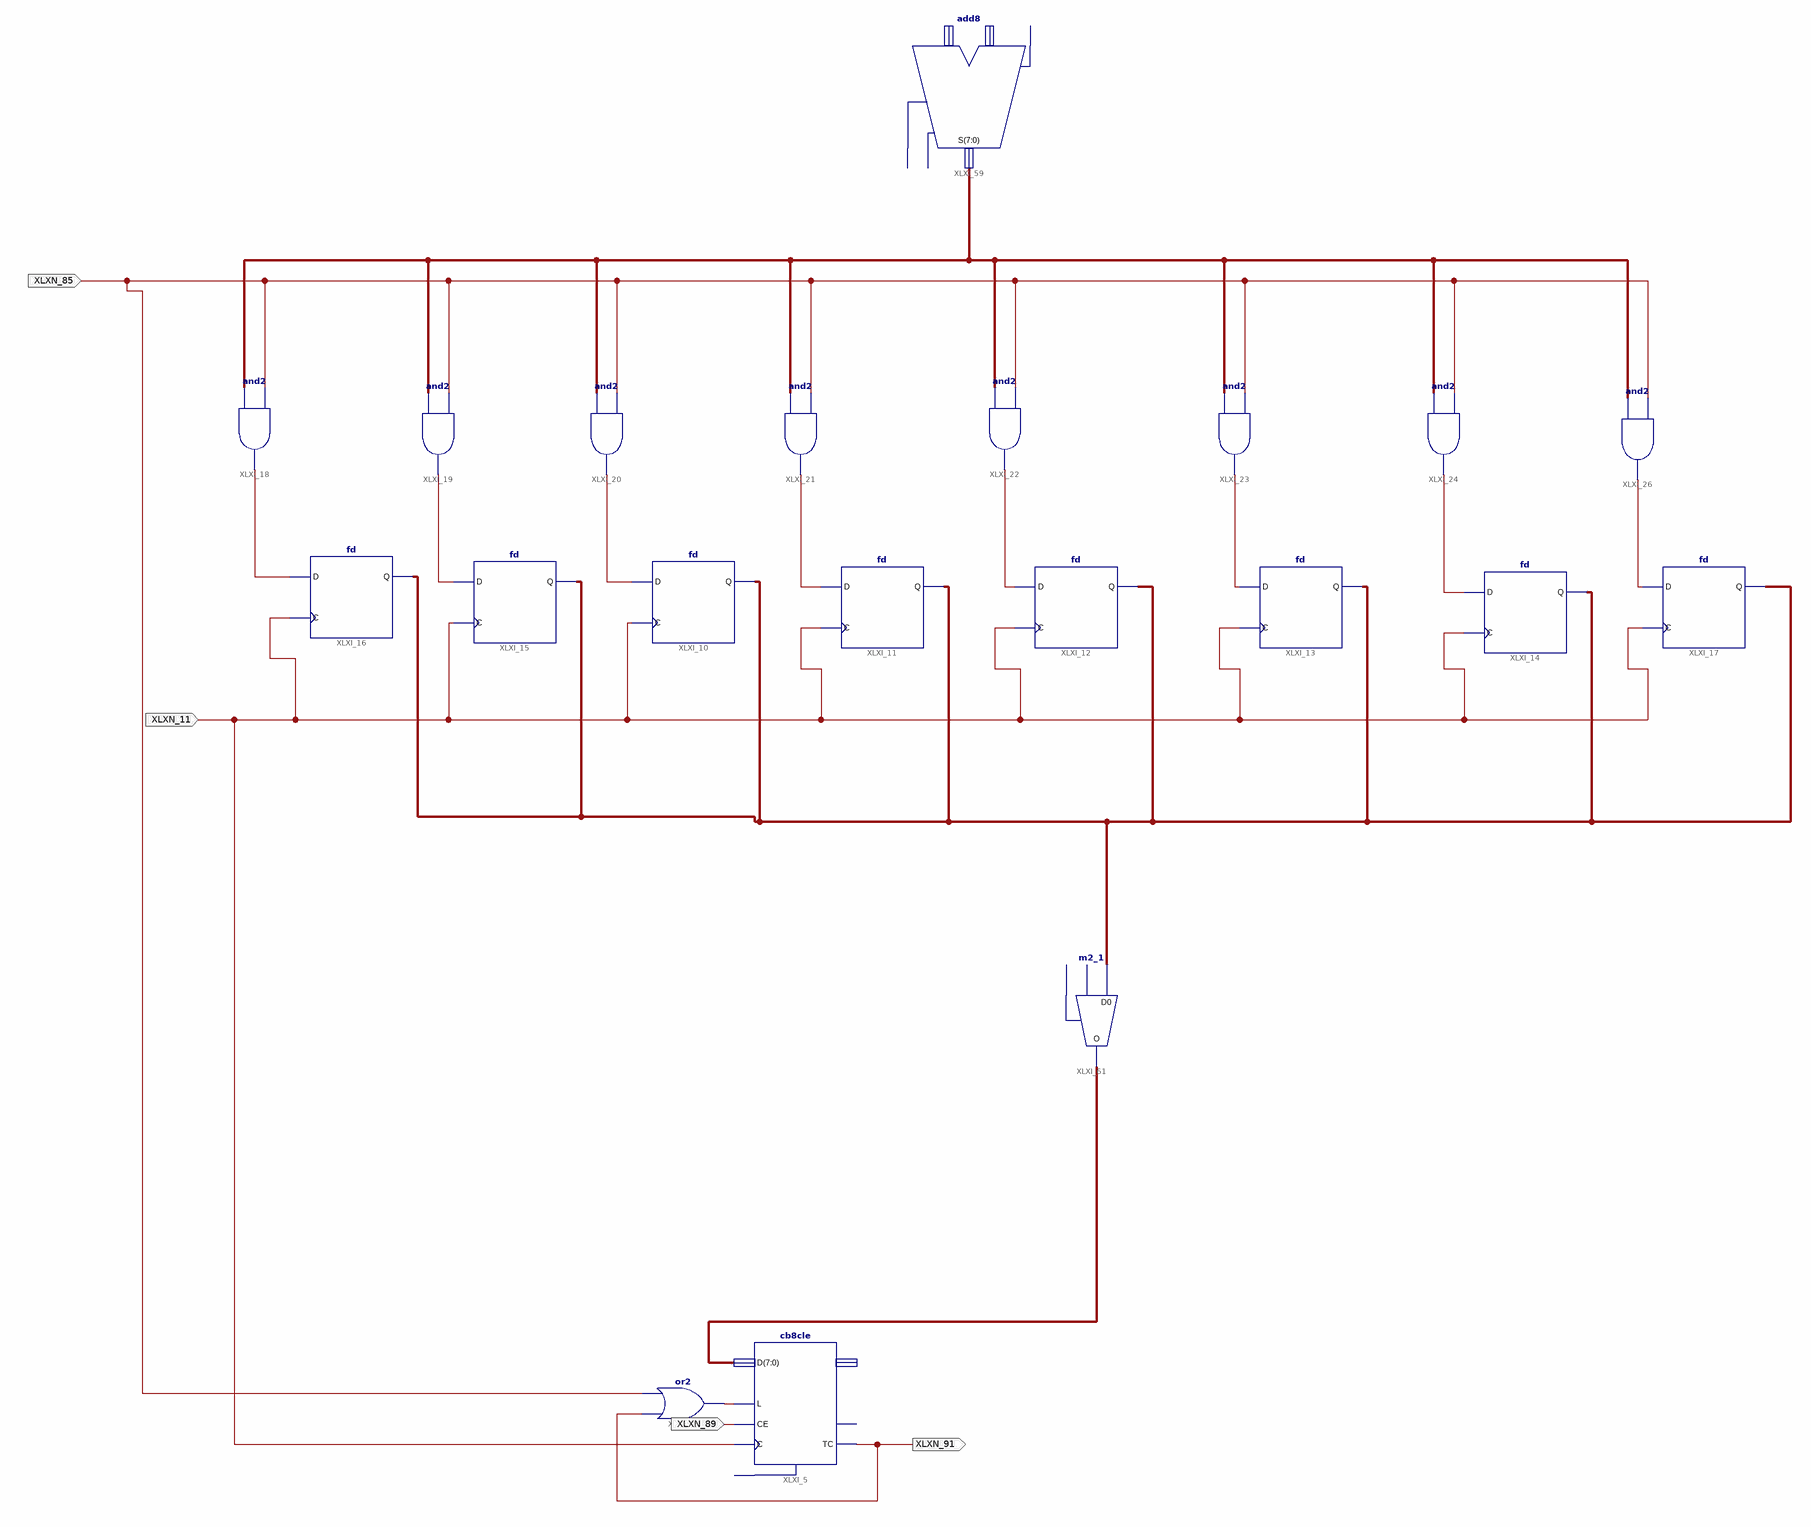
[diagram p0: schematic sheet 1]
// Xilinx ISE schematic timer.sch (spartan3e) as structural Verilog: 20 symbols, 4 ports
module timer (
  input  XLXN_11,
  input  XLXN_85,
  input  XLXN_89,
  output XLXN_91
);

  wire XLXN_12, XLXN_13, XLXN_14, XLXN_15, XLXN_16, XLXN_18, XLXN_19, XLXN_20, XLXN_88;
  wire [7:0] XLXN_87, XLXN_99, XLXN_101;

  fd XLXI_13 (.C(XLXN_11), .D(XLXN_18), .Q(XLXN_99));
  fd XLXI_12 (.C(XLXN_11), .D(XLXN_16), .Q(XLXN_99));
  fd XLXI_11 (.C(XLXN_11), .D(XLXN_15), .Q(XLXN_99));
  fd XLXI_10 (.C(XLXN_11), .D(XLXN_14), .Q(XLXN_99));
  fd XLXI_15 (.C(XLXN_11), .D(XLXN_13), .Q(XLXN_99));
  fd XLXI_16 (.C(XLXN_11), .D(XLXN_12), .Q(XLXN_99));
  fd XLXI_17 (.C(XLXN_11), .D(XLXN_20), .Q(XLXN_99));
  fd XLXI_14 (.C(XLXN_11), .D(XLXN_19), .Q(XLXN_99));
  assign XLXN_12 = XLXN_101 & {8{XLXN_85}};  // and2 XLXI_18, 8 bits wide
  assign XLXN_13 = XLXN_101 & {8{XLXN_85}};  // and2 XLXI_19, 8 bits wide
  assign XLXN_14 = XLXN_101 & {8{XLXN_85}};  // and2 XLXI_20, 8 bits wide
  assign XLXN_15 = XLXN_101 & {8{XLXN_85}};  // and2 XLXI_21, 8 bits wide
  assign XLXN_16 = XLXN_101 & {8{XLXN_85}};  // and2 XLXI_22, 8 bits wide
  assign XLXN_18 = XLXN_101 & {8{XLXN_85}};  // and2 XLXI_23, 8 bits wide
  assign XLXN_19 = XLXN_101 & {8{XLXN_85}};  // and2 XLXI_24, 8 bits wide
  assign XLXN_20 = XLXN_101 & {8{XLXN_85}};  // and2 XLXI_26, 8 bits wide
  add8 XLXI_59 (.S(XLXN_101));  // open: A, B, CI, CO, OFL
  cb8cle XLXI_5 (.C(XLXN_11), .CE(XLXN_89), .D(XLXN_87), .L(XLXN_88), .TC(XLXN_91));  // open: CLR, CEO, Q
  or XLXI_60 (XLXN_88, XLXN_91, XLXN_85);
  m2_1 XLXI_61 (.D0(XLXN_99), .O(XLXN_87));  // open: D1, S0
endmodule
